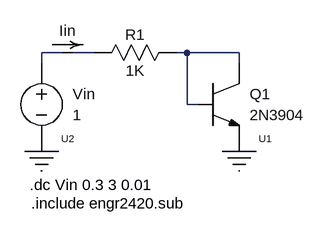
[diagram p0: schematic resdiode.asc]
resdiode.asc, the LTspice schematic file:
Version 4
SHEET 1 880 680
WIRE 96 96 64 96
WIRE 144 96 112 96
WIRE 288 96 272 96
WIRE 368 96 288 96
WIRE 64 112 64 96
WIRE 368 112 368 96
WIRE 288 176 288 96
WIRE 304 176 288 176
SYMBOL cktsym\\resistor 208 96 R90
WINDOW 3 12 0 VTop 0
WINDOW 0 -12 0 VBottom 0
SYMATTR Value 1K
SYMATTR InstName R1
SYMBOL cktsym\\npn 368 176 R0
SYMATTR Value 2N3904
SYMATTR InstName Q1
SYMBOL cktsym\\gnd 368 240 R0
SYMATTR InstName U1
SYMBOL cktsym\\vsource 64 176 R0
SYMATTR Value 1
SYMATTR InstName Vin
SYMBOL cktsym\\gnd 64 240 R0
SYMATTR InstName U2
SYMBOL cktsym\\ammeter1 96 96 R270
WINDOW 0 18 8 VTop 0
SYMATTR InstName Iin
TEXT 46 300 Left 0 !.dc Vin 0.3 3 0.01
TEXT 48 328 Left 0 !.include engr2420.sub

The netlist it stands for:
* resdiode.asc
R1 N003 N002 1K
Q1 N003 N003 P001 0 2N3904
XU1 P001 gnd  ; pins GND
Vin N001 P002 1
XU2 P002 gnd  ; pins GND
V§Iin N001 N002 0
.model NPN NPN
.model PNP PNP
.lib standard.bjt
.dc Vin 0.3 3 0.01
.include engr2420.sub
.backanno
.end